# Altium project CMTestBoard.PrjPcb (part 1 of 2)
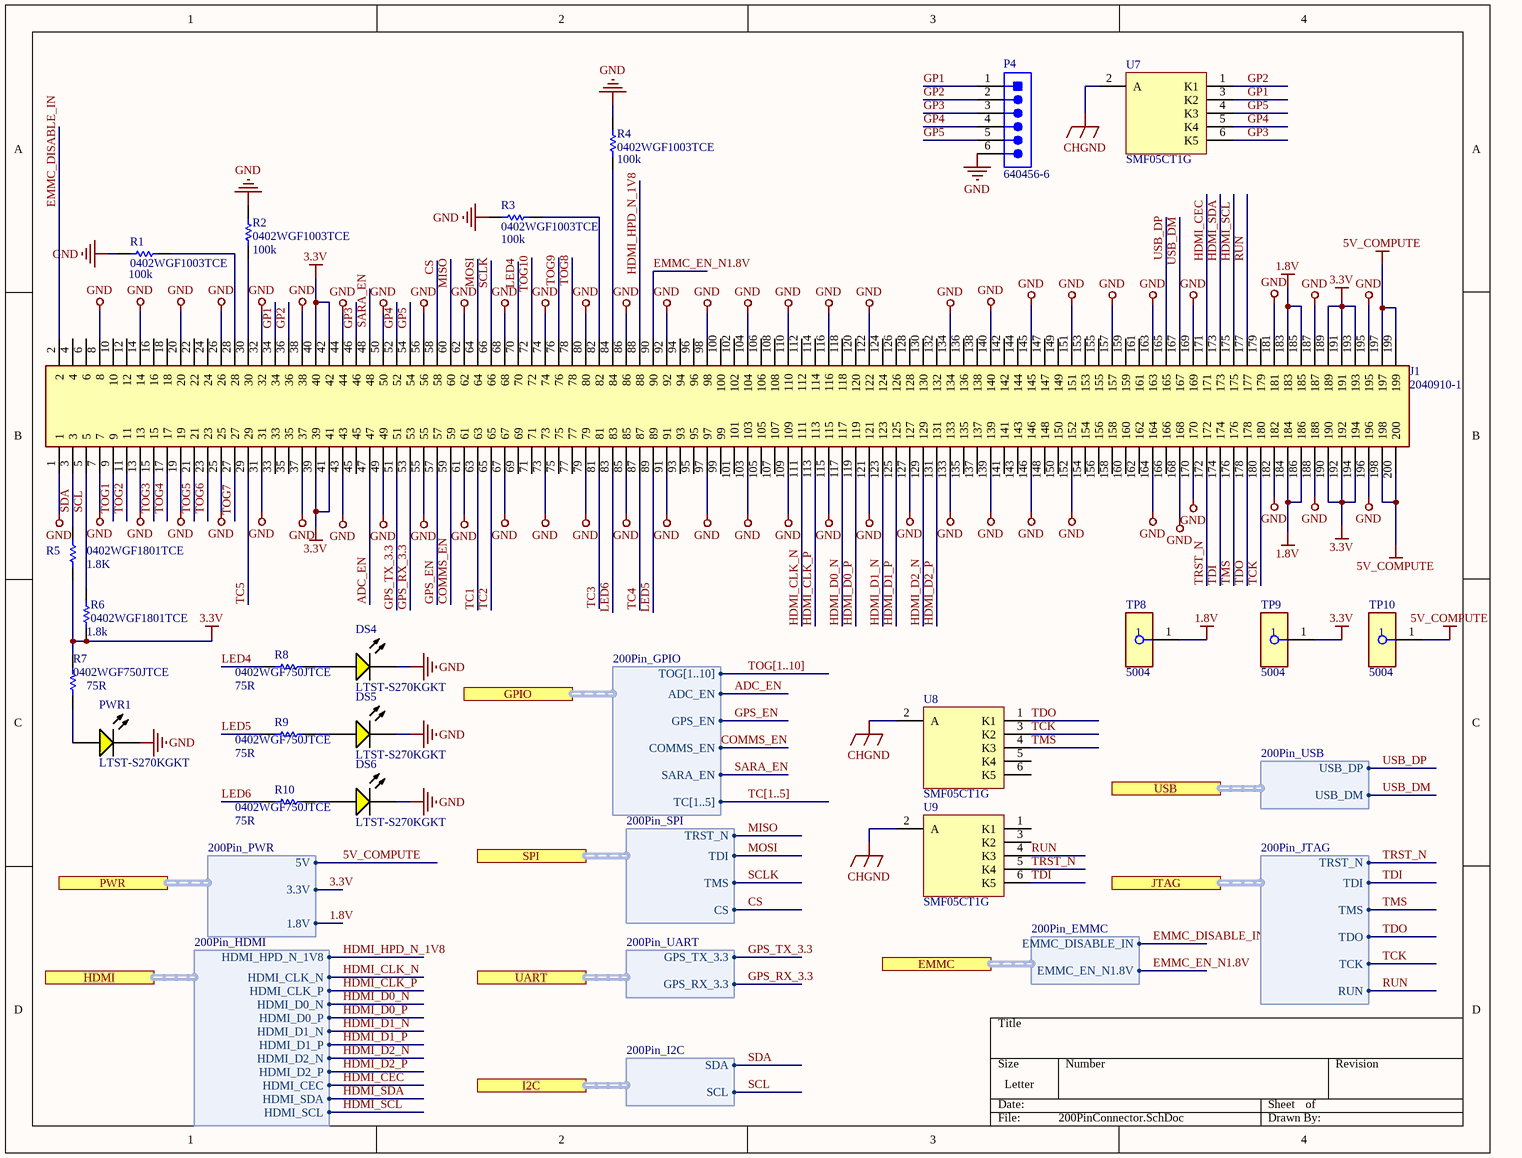
[diagram p0: 200PinConnector.SchDoc]
5 sheets, 156 parts. Net scope: flat (ports and power ports of the same name join across sheets).
Board file: CMTestBoard.PcbDoc
Sheets:
  200PinConnector.SchDoc
  CMPower.SchDoc
  Peripherals.SchDoc
  XC95144XL.SchDoc
  STM32F4.SchDoc

## Sheet 200PinConnector.SchDoc
size Letter

### Parts
DS4  LTST-S270KGKT  [AVAG-HSMX-C190_V]
DS5  LTST-S270KGKT  [AVAG-HSMX-C190_V]
DS6  LTST-S270KGKT  [AVAG-HSMX-C190_V]
J1  2040910-1  [20409101]
P4  640456-6  [TECO-640456-6_V]
PWR1  LTST-S270KGKT  [AVAG-HSMX-C190_V]
R1  0402WGF1003TCE  [0402]
R2  0402WGF1003TCE  [0402]
R3  0402WGF1003TCE  [0402]
R4  0402WGF1003TCE  [0402]
R5  0402WGF1801TCE  value 1.8K  [0402]
R6  0402WGF1801TCE  [0402]
R7  0402WGF750JTCE  [RESC1005X40X25ML05T10]
R8  0402WGF750JTCE  [RESC1005X40X25ML05T10]
R9  0402WGF750JTCE  [RESC1005X40X25ML05T10]
R10  0402WGF750JTCE  [RESC1005X40X25ML05T10]
TP8  5004  [FP-5004-MFG]
TP9  5004  [FP-5004-MFG]
TP10  5004  [FP-5004-MFG]
U7  SMF05CT1G  [ONSC-SC70-6-419B-02_W_V]
U8  SMF05CT1G  [ONSC-SC70-6-419B-02_W_V]
U9  SMF05CT1G  [ONSC-SC70-6-419B-02_W_V]

### Ports
EMMC (harness 200Pin_EMMC), GPIO (harness 200Pin_GPIO), HDMI (harness 200Pin_HDMI), I2C (harness 200Pin_I2C), JTAG (harness 200Pin_JTAG), PWR (harness 200Pin_PWR), SPI (harness 200Pin_SPI), UART (harness 200Pin_UART), USB (harness 200Pin_USB)

### Harnesses
200Pin_USB: USB_DP, USB_DM
200Pin_JTAG: TRST_N, TDI, TMS, TDO, TCK, RUN
200Pin_HDMI: HDMI_HPD_N_1V8, HDMI_CLK_N, HDMI_CLK_P, HDMI_D0_N, HDMI_D0_P, HDMI_D1_N, HDMI_D1_P, HDMI_D2_N, HDMI_D2_P, HDMI_CEC, HDMI_SDA, HDMI_SCL
200Pin_PWR: 5V, 3.3V, 1.8V
200Pin_I2C: SDA, SCL
200Pin_UART: GPS_TX_3.3, GPS_RX_3.3
200Pin_SPI: TRST_N, TDI, TMS, CS
200Pin_EMMC: EMMC_DISABLE_IN, EMMC_EN_N1.8V
200Pin_GPIO: TOG[1..10], ADC_EN, GPS_EN, COMMS_EN, SARA_EN, TC[1..5]

### Nets
1.8V: J1.183 J1.184 J1.185 J1.186 TP8.1 ; port PWR.1.8V
3.3V: J1.39 J1.40 J1.41 J1.42 J1.189 J1.190 J1.191 J1.192 J1.193 J1.194 R5.1 R6.1 R7.1 TP9.1 ; port PWR.3.3V
5V_COMPUTE: J1.197 J1.198 J1.199 J1.200 TP10.1 ; port PWR.5V  [project net 5V]
CHGND: U7.2(A) U8.2(A) U9.2(A)
GND: DS4.2(K) DS5.2(K) DS6.2(K) J1.1 J1.7 J1.8 J1.13 J1.14 J1.19 J1.20 J1.25 J1.26 J1.31 J1.32 J1.37 J1.38 J1.43 J1.44 J1.49 J1.50 J1.55 J1.56 J1.61 J1.62 J1.67 J1.68 J1.73 J1.74 J1.79 J1.80 J1.85 J1.86 J1.91 J1.92 J1.97 J1.98 J1.103 J1.104 J1.109 J1.110 J1.115 J1.116 J1.121 J1.122 J1.127 J1.133 J1.134 J1.139 J1.140 J1.145 J1.146 J1.151 J1.152 J1.157 J1.163 J1.164 J1.168 J1.169 J1.170 J1.181 J1.182 J1.187 J1.188 J1.195 J1.196 P4.6 PWR1.2(K) R1.2 R2.2 R3.2 R4.2
ADC_EN: J1.47 ; port GPIO.ADC_EN
COMMS_EN: J1.59 ; port GPIO.COMMS_EN
CS: J1.58 ; port SPI.CS
EMMC_DISABLE_IN: J1.2 ; port EMMC.EMMC_DISABLE_IN
EMMC_EN_N1.8V: J1.90 ; port EMMC.EMMC_EN_N1.8V
GP1: J1.34 P4.1 U7.3(K2)
GP2: J1.36 P4.2 U7.1(K1)
GP3: J1.46 P4.3 U7.6(K5)
GP4: J1.52 P4.4 U7.5(K4)
GP5: J1.54 P4.5 U7.4(K3)
GPS_EN: J1.57 ; port GPIO.GPS_EN
GPS_RX_3.3: J1.53 ; port UART.GPS_RX_3.3
GPS_TX_3.3: J1.51 ; port UART.GPS_TX_3.3
HDMI_CEC: J1.171 ; port HDMI.HDMI_CEC
HDMI_CLK_N: J1.111 ; port HDMI.HDMI_CLK_N
HDMI_CLK_P: J1.113 ; port HDMI.HDMI_CLK_P
HDMI_D0_N: J1.117 ; port HDMI.HDMI_D0_N
HDMI_D0_P: J1.119 ; port HDMI.HDMI_D0_P
HDMI_D1_N: J1.123 ; port HDMI.HDMI_D1_N
HDMI_D1_P: J1.125 ; port HDMI.HDMI_D1_P
HDMI_D2_N: J1.129 ; port HDMI.HDMI_D2_N
HDMI_D2_P: J1.131 ; port HDMI.HDMI_D2_P
HDMI_HPD_N_1V8: J1.88 ; port HDMI.HDMI_HPD_N_1V8
HDMI_SCL: J1.175 ; port HDMI.HDMI_SCL
HDMI_SDA: J1.173 ; port HDMI.HDMI_SDA
LED4: J1.70 R8.2
LED5: J1.89 R9.2
LED6: J1.83 R10.2
MISO: J1.60 ; port SPI.TRST_N
MOSI: J1.64 ; port SPI.TDI
RUN: J1.177 U9.4(K3) ; port JTAG.RUN
SARA_EN: J1.48 ; port GPIO.SARA_EN
SCL: J1.5 R6.2 ; port I2C.SCL
SCLK: J1.66 ; port SPI.TMS
SDA: J1.3 R5.2 ; port I2C.SDA
TC1: J1.63
TC2: J1.65
TC3: J1.81
TC4: J1.87
TC5: J1.29
TCK: J1.180 U8.3(K2) ; port JTAG.TCK
TDI: J1.174 U9.6(K5) ; port JTAG.TDI
TDO: J1.178 U8.1(K1) ; port JTAG.TDO
TMS: J1.176 U8.4(K3) ; port JTAG.TMS
TOG1: J1.9
TOG2: J1.11
TOG3: J1.15
TOG4: J1.17
TOG5: J1.21
TOG6: J1.23
TOG7: J1.27
TOG8: J1.78
TOG9: J1.76
TOG10: J1.72
TRST_N: J1.172 U9.5(K4) ; port JTAG.TRST_N
USB_DM: J1.167 ; port USB.USB_DM
USB_DP: J1.165 ; port USB.USB_DP
NetDS4_1: DS4.1(A) R8.1
NetDS5_1: DS5.1(A) R9.1
NetDS6_1: DS6.1(A) R10.1
NetJ1_28: J1.28 R1.1
NetJ1_30: J1.30 R2.1
NetJ1_82: J1.82 R3.1
NetJ1_84: J1.84 R4.1
NetPWR1_1: PWR1.1(A) R7.2

Not connected (* = marked no-connect by the designer): J1 4 6 10 12 16 18 22 24 33 35 45 69 71 75 77 93 94 95 96 99 100 101 102 105 106 107 108 112 114 118 120 124 126 128 130 132 135 136 137 138 141 142 143 144 147 148 149 150 153 154 155 156 158 159 160 161 162 166 179; U8 5(K4) 6(K5); U9 1(K1) 3(K2)

### Buses and harness runs
bus TC[1..5]
bus TOG[1..10]

### Notes on the sheet
- (near R4) 100k
- (near R1) 100k
- (near R2) 100k
- (near R3) 100k
- (near R6) 1.8k
- (near R7) 75R
- (near R8) 75R
- (near R9) 75R
- (near R10) 75R

### Library data of the parts
DS4-DS6 PWR1 = CMP-1744-00003-1: LED Uni-Color Yellow, 65 mW, 20 mA, -40 to 85 degC, 2-Pin SMD, RoHS, Tape and Reel; Tolerance: 1%; Voltage Rating: 50 V; Power Rating: 100 mW; Case\Package: 0603; Resistance: 390 Ohm; Min Operating Temperature: -55 degC; Length: 1.6 mm; ComponentLink3Description: Package Specification; Mount: Surface Mount; PackageReference: HSMX-C190; ComponentLink2Description: Datasheet; DatasheetVersion: Mar-12; Case Code (Metric): 1608; Pins: 2; Package Quantity: 5000; ComponentLink2URL: http://docs.avagotech.com/docs/AV02-0551EN; ComponentLink1Description: Manufacturer URL; RoHSCompliant: true; Packaging: Tape and Reel; PackageDescription: 2-Pin Surface Mount Device, Body 1.6 x 0.8 mm, Height 0.9 mm; REACH SVHC: No SVHC; ComponentLink3URL: http://www.fairchildsemi.com/dwg/MA/MA03D.pdf; Voltage Rating (DC): 50 V; Width: 0.8 mm; ComponentLink1URL: http://www.avagotech.com/; Max Operating Temperature: 155 degC; Case Code (Imperial): 0603; Height: 0.45 mm
J1 = 2040910-1: 200 Pin Connector; Manufacturer_Name: TE Connectivity; Datasheet Link: https://www.arrow.com/en/products/2040910-1/te-connectivity; Height: 15mm; Manufacturer_Part_Number: 2040910-1; Arrow Part Number: 2040910-1; Arrow Price/Stock: https://www.arrow.com/en/products/2040910-1/te-connectivity; Mouser Part Number: 571-2040910-1; Mouser Price/Stock: https://www.mouser.co.uk/ProductDetail/TE-Connectivity/2040910-1?qs=kAqyOuzYGe9tF8FZbDgYRA%3D%3D
P4 = CMP-2000-05661-1: Male Header, Pitch 2.54 mm, 1 x 6 Position, Height 10.03 mm, Tail Length 3.56 mm, -55 to 105 degC, Bulk; Manufacturer: TE Connectivity; Contact Centerline Spacing: 0.100 / in.; Number of Contacts: 6; Current, Rating: 5 / A; Agency Approvals: CSA,UL; Material, Contact: CopperAlloy; Mounting Hole Size: 0.04 / "; Brand/Series: MTA-100Series; Pin Spacing: 0.1 / "; Mount Angle: Vertical; Contact Termination Area Plating: Tin; Angle: Straight; Primary Type: InterconnectSystem; Standards: RoHSCompliant,ELVCompliant,UL94V-0; Temperature, Operating: -55to+105 / °C; Material, Housing: Polyester; Special Features: Pinstrip; Color, Housing: White; Connector Type: MTA-100; Voltage, Rating: 250 / V; Termination: Solder; Package Reference: 640456-6; Size, Post: 0.025 / in.; Color: White; Datasheet URL: https://datasheet.ciiva.com/25618/0900766b80eb7fdd-25618163.pdf; Manufacturer URL: http://www.te.com/; Mounting Type: PCMount; Length, Pin: 0.14 / "; Type: PCBPlug; Length, Overall: 0.6 / "; Mounting Technology: ThroughHole; Number of Rows: 1; Contact Shape: Square; Contact Mating Area Plating: Tin; Datasheet Version: Rev. W, 05/2005; Number of Positions: 6; Package Description: Male Header, Pitch 2.54 mm, 1 x 6 Position, Height 10.03 mm, Tail Length 3.56 mm; Contact Plating: Tin; Length, Terminal Post: 0.14 / in.; Flammability Rating: UL94V-0
R1-R4 = Res1: 100k 0402; Published: 8-Jun-2000; LatestRevisionDate: 17-Jul-2002; LatestRevisionNote: Re-released for DXP Platform.; PackageReference: AXIAL-0.3; Publisher: Altium Limited; PackageDescription: Axial Device, Thru-Hole; 2 Leads; 0.3 in Pin Spacing
  R1: Case Code (Imperial): 0402
R5 R6 = Res1: 1.8k 0402; Published: 8-Jun-2000; LatestRevisionDate: 17-Jul-2002; LatestRevisionNote: Re-released for DXP Platform.; PackageReference: AXIAL-0.3; Publisher: Altium Limited; PackageDescription: Axial Device, Thru-Hole; 2 Leads; 0.3 in Pin Spacing
R7-R10 = CMP-2002-07344-1: 75R 0402; Part Number: RC0402FR-07100RL; Manufacturer: Yageo / Phycomp
TP8-TP10 = CMP-2000-05575-2: PC TEST POINT MINIATURE YELLOW; Manufacturer: Keystone; Number Of Contacts: 1; Is Female: yes; Device Class L1: Connectors; Manufacturer Part Number: 5004; Digikey Description: PC TEST POINT MINIATURE YELLOW; ComponentLink2URL: https://www.keyelco.com/product-pdf.cfm?p=1313; Lead Free: Yes; ComponentLink2Description: Datasheet; Category: Conn; Height: 4.72mm; Octopart: https://octopart.com/5004-keystone-28591; Mouser Description: TEST POINT PC MINI .040"D YELLOW; Device Class L3: unset; Contact Material: Silver; Package: 5004; Automotive: No; Device Class L2: unset; RoHS: TRUE
U7-U9 = CMP-1061-00155-1: 5-Line Transient Voltage Suppressor Array, 6-Pin SC70, Pb-Free, Tape and Reel; Manufacturer: On Semiconductor; PPK Max (W): 100; Direction: Unidirectional; IR Max (uA): 5; PackageDescription: 6-Pin Small Outline Transistor, Body 2 x 1.25 mm, Pitch 0.65 mm; PackageReference: SC70-6-419B-02_W; ComponentLink2Description: Datasheet; Mounting Technology: Surface Mount; Packing: Tape and Reel; DatasheetVersion: Rev. 4; ComponentLink1Description: Manufacturer URL; ComponentLink2URL: http://www.onsemi.com/pub_link/Collateral/SMF05C-D.PDF; ComponentLink3Description: Package Specification; ComponentLink1URL: http://www.onsemi.com/; ComponentLink3URL: http://www.onsemi.com/pub_link/Collateral/SMF05C-D.PDF; PackageVersion: Rev. W; PartNumber: SMF05CT1G; RoHS: Pb-Free

## Sheet CMPower.SchDoc
size Letter
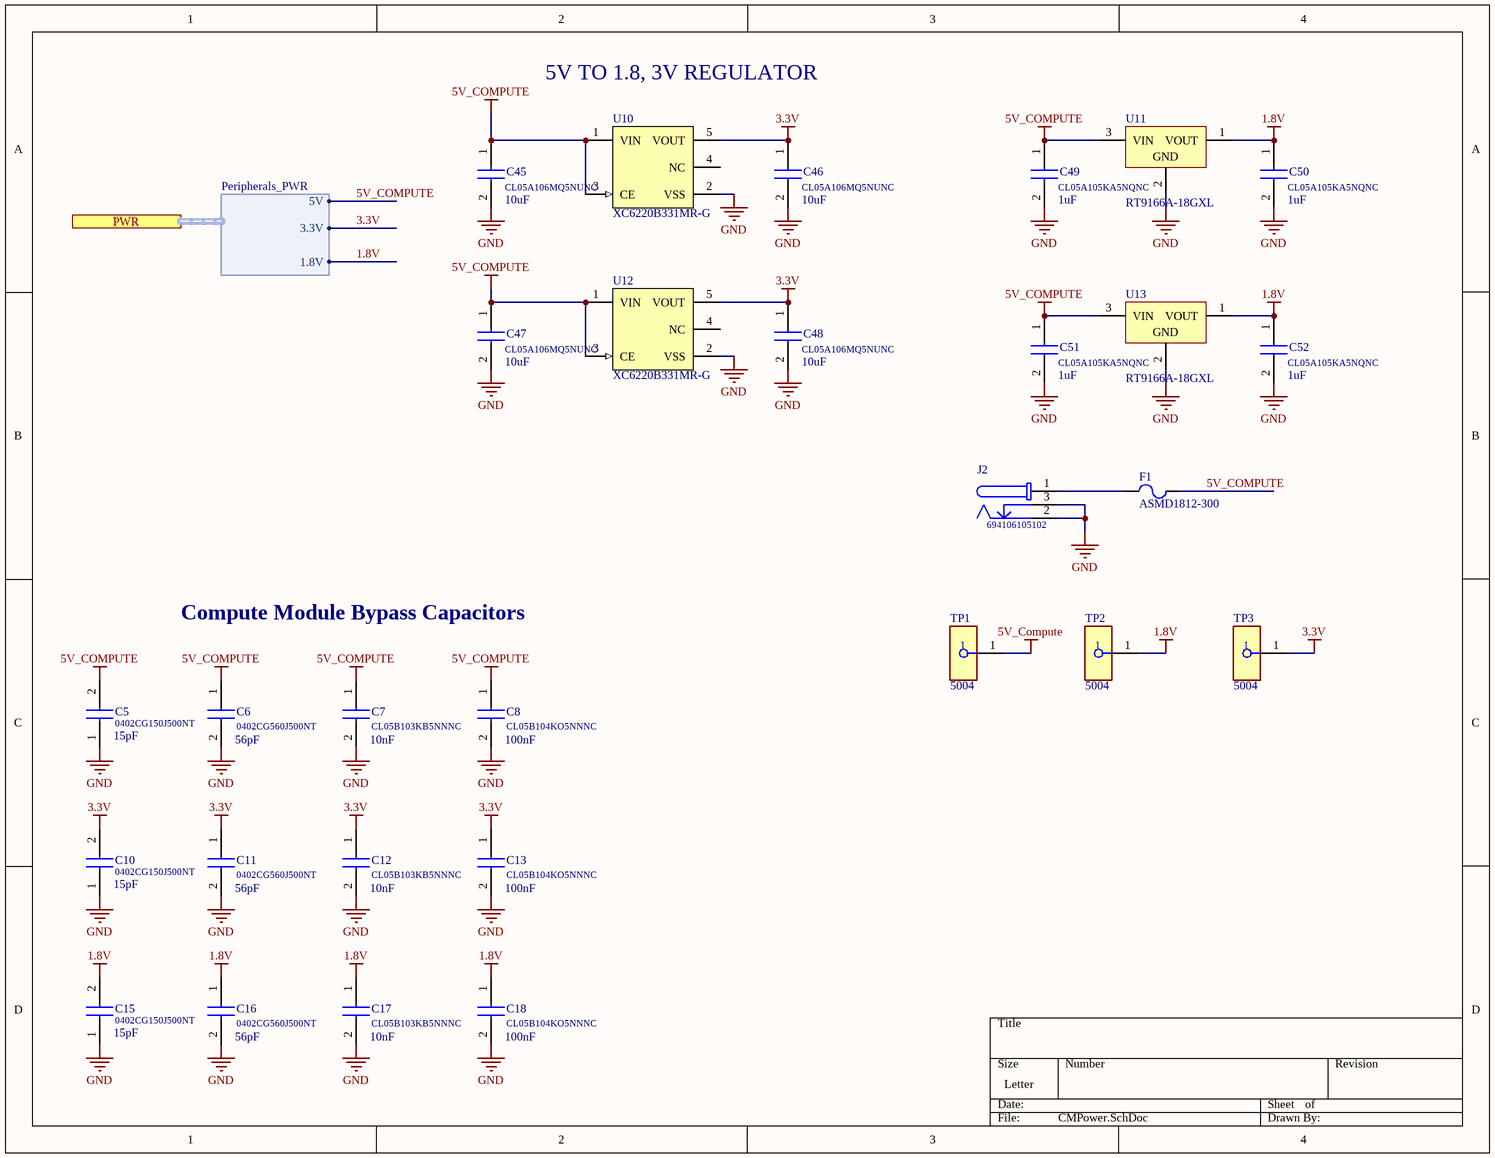
[diagram p1: CMPower.SchDoc]

### Parts
C5  0402CG150J500NT  value 15pF  [CAPC1005X90N]
C6  0402CG560J500NT  value 56pF  [CAPC1005X55N]
C7  CL05B103KB5NNNC  value 10nF  [CAPC1005X55N]
C8  CL05B104KO5NNNC  value 100nF  [CAPC1005X55N]
C10  0402CG150J500NT  value 15pF  [CAPC1005X90N]
C11  0402CG560J500NT  value 56pF  [CAPC1005X55N]
C12  CL05B103KB5NNNC  value 10nF  [CAPC1005X55N]
C13  CL05B104KO5NNNC  value 100nF  [CAPC1005X55N]
C15  0402CG150J500NT  value 15pF  [CAPC1005X90N]
C16  0402CG560J500NT  value 56pF  [CAPC1005X55N]
C17  CL05B103KB5NNNC  value 10nF  [CAPC1005X55N]
C18  CL05B104KO5NNNC  value 100nF  [CAPC1005X55N]
C45  CL05A106MQ5NUNC  value 10uF  [CAPC1005X55N]
C46  CL05A106MQ5NUNC  value 10uF  [CAPC1005X55N]
C47  CL05A106MQ5NUNC  value 10uF  [CAPC1005X55N]
C48  CL05A106MQ5NUNC  value 10uF  [CAPC1005X55N]
C49  CL05A105KA5NQNC  value 1uF  [CAPC1005X55N]
C50  CL05A105KA5NQNC  value 1uF  [CAPC1005X55N]
C51  CL05A105KA5NQNC  value 1uF  [CAPC1005X55N]
C52  CL05A105KA5NQNC  value 1uF  [CAPC1005X55N]
F1  ASMD1812-300  [LFUS-FUSE1812-71_V]
J2  694106105102  [694106105102]
TP1  5004  [FP-5004-MFG]
TP2  5004  [FP-5004-MFG]
TP3  5004  [FP-5004-MFG]
U10  XC6220B331MR-G  [TORX-SOT-25-5_M]
U11  RT9166A-18GXL  [SOT-89_N]
U12  XC6220B331MR-G  [TORX-SOT-25-5_M]
U13  RT9166A-18GXL  [SOT-89_N]

### Ports
PWR (harness Peripherals_PWR)

### Harnesses
Peripherals_PWR: 5V, 3.3V, 1.8V

### Nets
1.8V: C15.2 C16.1 C17.1 C18.1 C50.1 C52.1 TP2.1 U11.1(VOUT) U13.1(VOUT) ; port PWR.1.8V
3.3V: C10.2 C11.1 C12.1 C13.1 C46.1 C48.1 TP3.1 U10.5(VOUT) U12.5(VOUT) ; port PWR.3.3V
5V_COMPUTE: C5.2 C6.1 C7.1 C8.1 C45.1 C47.1 C49.1 C51.1 F1.2 TP1.1 U10.1(VIN) U10.3(CE) U11.3(VIN) U12.1(VIN) U12.3(CE) U13.3(VIN) ; port PWR.5V  [project net 5V]
GND: C5.1 C6.2 C7.2 C8.2 C10.1 C11.2 C12.2 C13.2 C15.1 C16.2 C17.2 C18.2 C45.2 C46.2 C47.2 C48.2 C49.2 C50.2 C51.2 C52.2 J2.2 J2.3 U10.2(VSS) U11.2(GND) U12.2(VSS) U13.2(GND)
NetF1_1: F1.1 J2.1

Not connected (* = marked no-connect by the designer): U10 4(NC); U12 4(NC)

### Notes on the sheet
- 5V TO 1.8, 3V REGULATOR
- Compute Module Bypass Capacitors

### Library data of the parts
C5 C10 C15 = C0402C150J4GACTU: 15pF 0402; Manufacturer_Name: Kemet; Datasheet Link: https://content.kemet.com/datasheets/KEM_C1002_X7R_SMD.pdf; Height: 0.55mm; Manufacturer_Part_Number: C0402C150J4GACTU; Arrow Part Number: C0402C150J4GACTU; Arrow Price/Stock: https://www.arrow.com/en/products/c0402c150j4gactu/kemet-corporation; Mouser Part Number: 80-C0402C150J4G; Mouser Price/Stock: https://www.mouser.com/Search/Refine.aspx?Keyword=80-C0402C150J4G
C6 C11 C16 = C0402C560K5RACTU: 56pF 0402; Manufacturer_Name: Kemet; Datasheet Link: https://content.kemet.com/datasheets/KEM_C1002_X7R_SMD.pdf; Height: 0.55mm; Manufacturer_Part_Number: C0402C560K5RACTU; Arrow Part Number: C0402C560K5RACTU; Mouser Part Number: 80-C0402C560K5RACTU; Mouser Price/Stock: https://www.mouser.co.uk/ProductDetail/KEMET/C0402C560K5RACTU?qs=gt1LBUVyoHmQZW5v3ySgNQ%3D%3D
C7 C12 C17 = C0402C103K8RACTU: 10nF 0402; Manufacturer_Name: Kemet; Datasheet Link: https://content.kemet.com/datasheets/KEM_C1002_X7R_SMD.pdf; Height: 0.55mm; Manufacturer_Part_Number: C0402C103K8RACTU; Arrow Part Number: C0402C103K8RACTU; Arrow Price/Stock: https://www.arrow.com/en/products/c0402c103k8ractu/kemet-corporation; Mouser Part Number: 80-C0402C103K8R; Mouser Price/Stock: https://www.mouser.co.uk/ProductDetail/KEMET/C0402C103K8RACTU?qs=JAINH4q0Y0HkMNTUebnT7w%3D%3D
C8 C13 C18 = C0402C560K5RACTU: 100nF 0402; Manufacturer_Name: Kemet; Datasheet Link: https://content.kemet.com/datasheets/KEM_C1002_X7R_SMD.pdf; Height: 0.55mm; Manufacturer_Part_Number: C0402C560K5RACTU; Arrow Part Number: C0402C560K5RACTU; Mouser Part Number: 80-C0402C560K5RACTU; Mouser Price/Stock: https://www.mouser.co.uk/ProductDetail/KEMET/C0402C560K5RACTU?qs=gt1LBUVyoHmQZW5v3ySgNQ%3D%3D
C45-C48 = C0402C560K5RACTU: 10uF 0402; Manufacturer_Name: Kemet; Datasheet Link: https://content.kemet.com/datasheets/KEM_C1002_X7R_SMD.pdf; Height: 0.55mm; Manufacturer_Part_Number: C0402C560K5RACTU; Arrow Part Number: C0402C560K5RACTU; Mouser Part Number: 80-C0402C560K5RACTU; Mouser Price/Stock: https://www.mouser.co.uk/ProductDetail/KEMET/C0402C560K5RACTU?qs=gt1LBUVyoHmQZW5v3ySgNQ%3D%3D
C49-C52 = C0402C560K5RACTU: 1uF 0402; Manufacturer_Name: Kemet; Datasheet Link: https://content.kemet.com/datasheets/KEM_C1002_X7R_SMD.pdf; Height: 0.55mm; Manufacturer_Part_Number: C0402C560K5RACTU; Arrow Part Number: C0402C560K5RACTU; Mouser Part Number: 80-C0402C560K5RACTU; Mouser Price/Stock: https://www.mouser.co.uk/ProductDetail/KEMET/C0402C560K5RACTU?qs=gt1LBUVyoHmQZW5v3ySgNQ%3D%3D
F1 = CMP-0257-00001-1: Resettable PTC, 1812, 3 A Ihold, 5 A Itrip, 8V max; PartNumber: 1812L150ZR; Itrip: 3 A; Vmax: 8 Vdc; Ihold: 1.5 A; Imax: 100 A; PackageReference: FUSE1812-71; ComponentLink1Description: Manufacturer URL; DatasheetVersion: 6/2012; ComponentLink2URL: http://www.littelfuse.com/products/resettable-ptcs/surface-mount/1812l/~/media/Electronics_Technical/Datasheets/Resettable_PTCs/Littelfuse_PTC_1812L_Datasheet.pdf; PackageVersion: 6/2012; PackageDescription: 2-Pin SMT Fuse, 4.55 x 3.24 mm Body; ComponentLink1URL: http://www.littelfuse.com/; ComponentLink2Description: Datasheet
J2 = CMP-1502-00176-1: DC Power Jack Connector with Pegs WR-DC, Male, Right Angled, SMT, 5 A, 24 V; Manufacturer: Wurth Elektronik; Plug Outer Diameter: 5.5mm; Opening Diameter: 6.4mm; Plug Inner Diameter: 2.05mm; Rated Current: 5A; Working Voltage: 24V; Publisher: WurthElektronik; Operating Temperature: -40to85degC; Packaging: TapeandReel; Part Number: 694106105102; Manufacturer URL: http://www.we-online.de; Mounting Technology: SMT; Gender: Male; Package Reference: 694106105102; Datasheet URL: http://katalog.we-online.de/em/datasheet/6941xx105102.pdf; Orientation: RightAngled
TP1-TP3 = CMP-2000-05575-2: as TP8 on sheet 200PinConnector; Device Class L1: Connectors; Manufacturer Part Number: 5004; Digikey Description: PC TEST POINT MINIATURE YELLOW; ComponentLink2URL: https://www.keyelco.com/product-pdf.cfm?p=1313; Lead Free: Yes; ComponentLink2Description: Datasheet; Category: Conn; Height: 4.72mm; Octopart: https://octopart.com/5004-keystone-28591; Mouser Description: TEST POINT PC MINI .040"D YELLOW; Device Class L3: unset; Contact Material: Silver; Package: 5004; Automotive: No; Device Class L2: unset; RoHS: TRUE
U10 U12 = CMP-0599-00001-2: 1A LDO Voltage Regulator with CL discharge, 3.3 V, 1000 mA, -45 to 85 degC, 5-Pin SOT-25, RoHS, Reel; Manufacturer: Torex; Output Voltage: 3.3 V; Maximum Output Current: 1000 mA; ComponentLink1Description: Manufacturer URL; ComponentLink2URL: http://www.torex.co.jp/english/products/voltage_regulators/data/XC6220.pdf; DatasheetVersion: ETR0341-010a; ComponentLink1URL: http://www.torex.co.jp/; Mounting Technology: Surface Mount; Operating Ambient Temperature: -40 to 85 degC; PackageReference: SOT-25-5; PackageDescription: 5-Pin Small Out-Line Transistor, Body 2.9 x 1.65 mm, Pitch 0.95 mm; PartNumber: XC6220B331MR-G; RoHS: TRUE; Packing: Reel; ComponentLink2Description: Datasheet
U11 U13 = CMP-0244-00406-1: Positive Voltage Regulator, 5V, 4-Pin SOT-89, Tape and Reel; PackageVersion: 2011; DatasheetVersion: 1/02/2011; PackageDescription: 3-Pin SOT-89 Package 1.5 mm Pitch, 4.1 mm Lead Span; PackageReference: SOT-89; ComponentLink2Description: Datasheet; ComponentLink1URL: http://www.st.com; ComponentLink1Description: Manufacturer URL; ComponentLink2URL: http://www.st.com/internet/com/TECHNICAL_RESOURCES/TECHNICAL_LITERATURE/DATASHEET/CD00000446.pdf

## Sheet Peripherals.SchDoc
size Letter
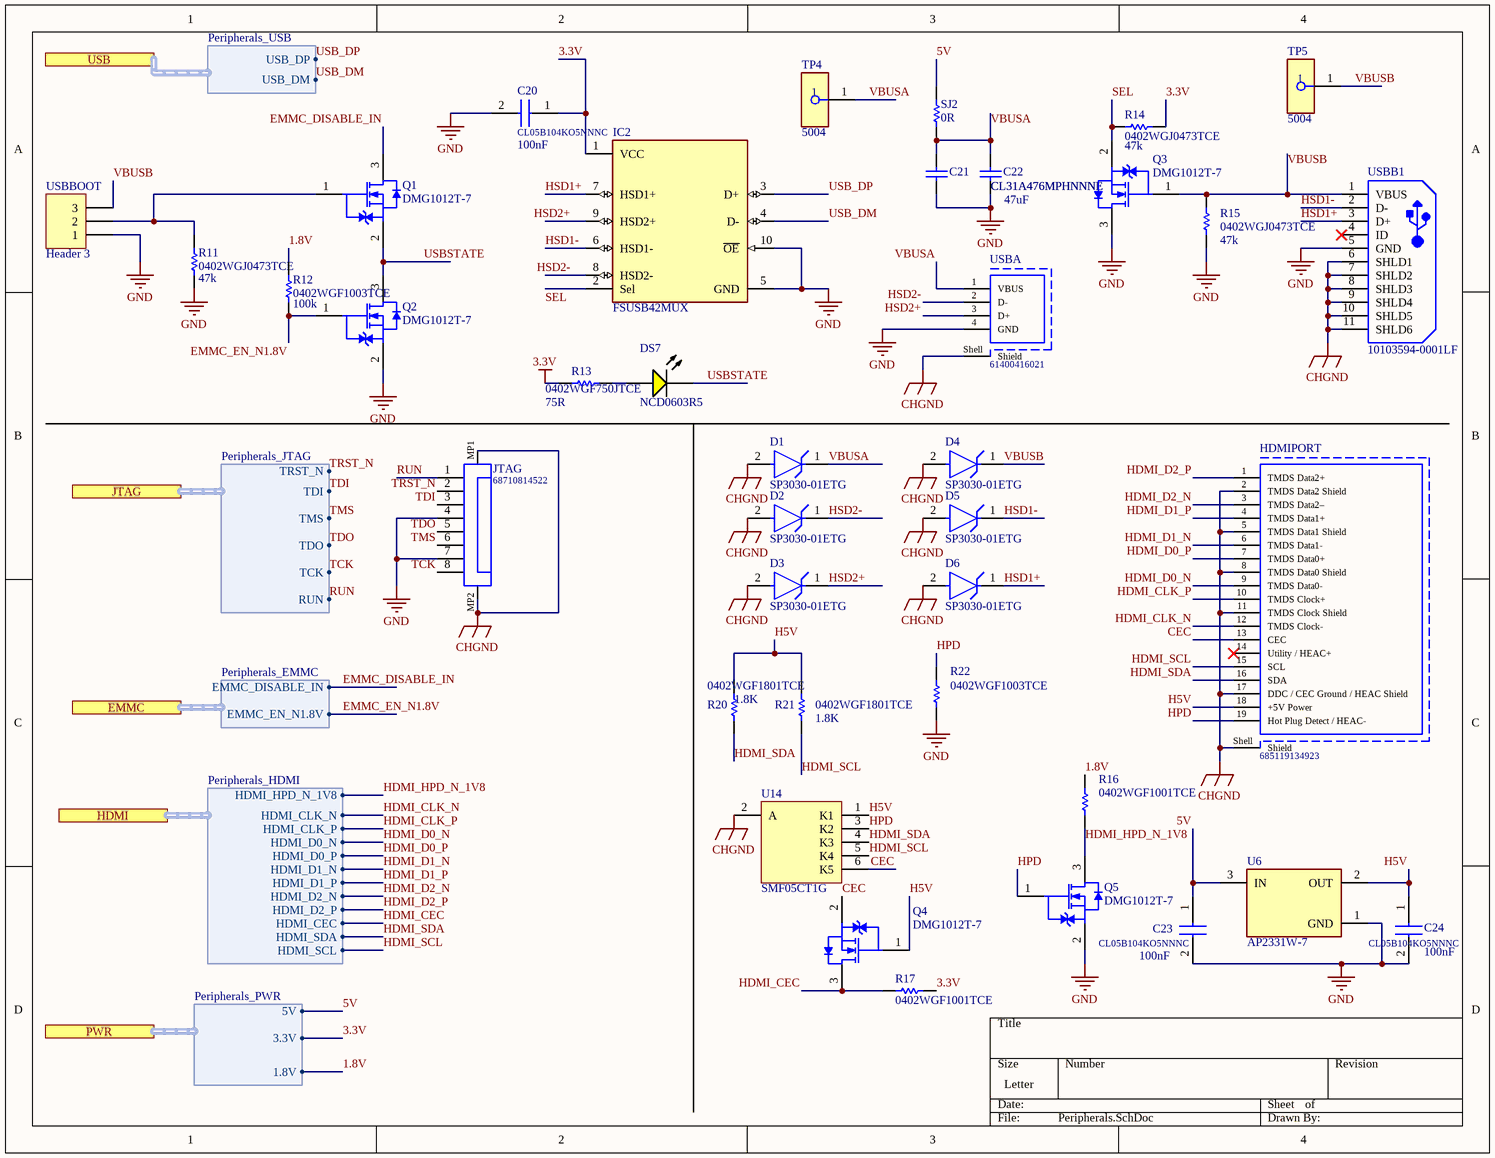
[diagram p2: Peripherals.SchDoc]

### Parts
(Parts that share a designator on the sheet are numbered #1, #2 ... from top to bottom, then left to right.)
C20#1  CL05B104KO5NNNC  value 100nF  [CAPC1005X55N]
C21#1  CL31A476MPHNNNE  [C1206]
C22#1  CL31A476MPHNNNE  [C1206]
C23#1  CL05B104KO5NNNC  value 100nF  [CAPC1005X55N]
C24#1  CL05B104KO5NNNC  value 100nF  [CAPC1005X55N]
D1  SP3030-01ETG  [FP-SP3030-MFG]
D2  SP3030-01ETG  [FP-SP3030-MFG]
D3  SP3030-01ETG  [FP-SP3030-MFG]
D4  SP3030-01ETG  [FP-SP3030-MFG]
D5  SP3030-01ETG  [FP-SP3030-MFG]
D6  SP3030-01ETG  [FP-SP3030-MFG]
DS7  NCD0603R5  [AVAG-HSMX-C190_V]
HDMIPORT  685119134923  [685119134923]
IC2  FSUSB42MUX  [FP-846AP-MFG]
JTAG  68710814522  [68710814522]
Q1  DMG1012T-7  [DIOD-SOT523-3_V]
Q2  DMG1012T-7  [DIOD-SOT523-3_V]
Q3  DMG1012T-7  [DIOD-SOT523-3_V]
Q4  DMG1012T-7  [DIOD-SOT523-3_V]
Q5  DMG1012T-7  [DIOD-SOT523-3_V]
R11#1  0402WGJ0473TCE  [0402-A]
R12#1  0402WGF1003TCE  [0402]
R13#1  0402WGF750JTCE  spec: 75R  [RESC1005X40X25ML05T10]
R14#1  0402WGJ0473TCE  [0402-A]
R15#1  0402WGJ0473TCE  [0402-A]
R16#1  0402WGF1001TCE  [0402]
R17  0402WGF1001TCE  [0402]
R20  0402WGF1801TCE  value 1.8K  [0402]
R21  0402WGF1801TCE  value 1.8K  [0402]
R22  0402WGF1003TCE  [0402]
SJ2  0R  [J1-0603]
TP4  5004  [FP-5004-MFG]
TP5  5004  [FP-5004-MFG]
U6  AP2331W-7  [FP-SC59-IPC_B]
U14  SMF05CT1G  [ONSC-SC70-6-419B-02_W_V]
USBA  61400416021  [61400416021]
USBB1  10103594-0001LF  [FCI-10103594-0001LF_V]
USBBOOT  Header 3  [HDR1X3]

### Ports
EMMC (harness Peripherals_EMMC), HDMI (harness Peripherals_HDMI), JTAG (harness Peripherals_JTAG), PWR (harness Peripherals_PWR), USB (harness Peripherals_USB)

### Harnesses
Peripherals_USB: USB_DP, USB_DM
Peripherals_HDMI: HDMI_HPD_N_1V8, HDMI_CLK_N, HDMI_CLK_P, HDMI_D0_N, HDMI_D0_P, HDMI_D1_N, HDMI_D1_P, HDMI_D2_N, HDMI_D2_P, HDMI_CEC, HDMI_SDA, HDMI_SCL
Peripherals_JTAG: TRST_N, TDI, TMS, TDO, TCK, RUN
Peripherals_PWR: 5V, 3.3V, 1.8V
Peripherals_EMMC: EMMC_DISABLE_IN, EMMC_EN_N1.8V

### Nets
1.8V: R12#1.2 R16#1.1 ; port PWR.1.8V
3.3V: C20#1.1 IC2.1(VCC) R13#1.2 R14#1.1 R17.2 ; port PWR.3.3V
5V: C23#1.1 SJ2.2 U6.3(IN) ; port PWR.5V
CHGND: D1.2(A) D2.2(A) D3.2(A) D4.2(A) D5.2(A) D6.2(A) HDMIPORT.2(TMDS_Data2_Shield) HDMIPORT.5(TMDS_Data1_Shield) HDMIPORT.8(TMDS_Data0_Shield) HDMIPORT.11(TMDS_Clock_Shield) HDMIPORT.17(DDC_/_CEC_Ground_/_HEAC_Shield) HDMIPORT.Shell(Shield) JTAG.MP1 JTAG.MP2 U14.2(A) USBA.Shell(Shield) USBB1.6(SHLD1) USBB1.7(SHLD2) USBB1.8(SHLD3) USBB1.9(SHLD4) USBB1.10(SHLD5) USBB1.11(SHLD6)
GND: C20#1.2 C21#1.1 C22#1.1 C23#1.2 C24#1.2 IC2.5(GND) IC2.10(~{OE}) JTAG.4 JTAG.7 Q2.2(S) Q3.3(D) Q5.2(S) R11#1.1 R15#1.1 R22.2 U6.1(GND) USBA.4(GND) USBB1.5(GND) USBBOOT.1
CEC: HDMIPORT.13(CEC) Q4.2(S) U14.6(K5)
EMMC_DISABLE_IN: Q1.3(D) ; port EMMC.EMMC_DISABLE_IN
EMMC_EN_N1.8V: Q2.1(G) R12#1.1 ; port EMMC.EMMC_EN_N1.8V
H5V: C24#1.1 HDMIPORT.18(+5V_Power) Q4.1(G) R20.2 R21.2 U6.2(OUT) U14.1(K1)
HDMI_CEC: Q4.3(D) R17.1 ; port HDMI.HDMI_CEC
HDMI_CLK_N: HDMIPORT.12(TMDS_Clock-) ; port HDMI.HDMI_CLK_N
HDMI_CLK_P: HDMIPORT.10(TMDS_Clock+) ; port HDMI.HDMI_CLK_P
HDMI_D0_N: HDMIPORT.9(TMDS_Data0-) ; port HDMI.HDMI_D0_N
HDMI_D0_P: HDMIPORT.7(TMDS_Data0+) ; port HDMI.HDMI_D0_P
HDMI_D1_N: HDMIPORT.6(TMDS_Data1-) ; port HDMI.HDMI_D1_N
HDMI_D1_P: HDMIPORT.4(TMDS_Data1+) ; port HDMI.HDMI_D1_P
HDMI_D2_N: HDMIPORT.3(TMDS_Data2–) ; port HDMI.HDMI_D2_N
HDMI_D2_P: HDMIPORT.1(TMDS_Data2+) ; port HDMI.HDMI_D2_P
HDMI_HPD_N_1V8: Q5.3(D) R16#1.2 ; port HDMI.HDMI_HPD_N_1V8
HDMI_SCL: HDMIPORT.15(SCL) R21.1 U14.5(K4) ; port HDMI.HDMI_SCL
HDMI_SDA: HDMIPORT.16(SDA) R20.1 U14.4(K3) ; port HDMI.HDMI_SDA
HPD: HDMIPORT.19(Hot_Plug_Detect_/_HEAC-) Q5.1(G) R22.1 U14.3(K2)
HSD1+: D6.1(C) IC2.7(HSD1+) USBB1.3(D+)
HSD1-: D5.1(C) IC2.6(HSD1-) USBB1.2(D-)
HSD2+: D3.1(C) IC2.9(HSD2+) USBA.3(D+)
HSD2-: D2.1(C) IC2.8(HSD2-) USBA.2(D-)
RUN: JTAG.1 ; port JTAG.RUN
SEL: IC2.2(Sel) Q3.2(S) R14#1.2
TCK: JTAG.8 ; port JTAG.TCK
TDI: JTAG.3 ; port JTAG.TDI
TDO: JTAG.5 ; port JTAG.TDO
TMS: JTAG.6 ; port JTAG.TMS
TRST_N: JTAG.2 ; port JTAG.TRST_N
USB_DM: IC2.4(D-) ; port USB.USB_DM
USB_DP: IC2.3(D+) ; port USB.USB_DP
USBSTATE: DS7.2(K) Q1.2(S) Q2.3(D)
VBUSA: C21#1.2 C22#1.2 D1.1(C) SJ2.1 TP4.1 USBA.1(VBUS)
VBUSB: D4.1(C) Q3.1(G) R15#1.2 TP5.1 USBB1.1(VBUS) USBBOOT.3
NetDS7_1: DS7.1(A) R13#1.1
NetQ1_1: Q1.1(G) R11#1.2 USBBOOT.2

Not connected (* = marked no-connect by the designer): HDMIPORT 14(Utility_/_HEAC+)*; USBB1 4(ID)*

### Notes on the sheet
- 47k
- (near C22#1) 47uF
- (near R11#1) 47k
- (near R15#1) 47k
- (near R12#1) 100k

### Library data of the parts
C20#1 C23#1 C24#1 = C0402C560K5RACTU: 100nF 0402; Manufacturer_Name: Kemet; Datasheet Link: https://content.kemet.com/datasheets/KEM_C1002_X7R_SMD.pdf; Height: 0.55mm; Manufacturer_Part_Number: C0402C560K5RACTU; Arrow Part Number: C0402C560K5RACTU; Mouser Part Number: 80-C0402C560K5RACTU; Mouser Price/Stock: https://www.mouser.co.uk/ProductDetail/KEMET/C0402C560K5RACTU?qs=gt1LBUVyoHmQZW5v3ySgNQ%3D%3D
C21#1 C22#1 = Cap: 47uF 1206; Published: 8-Jun-2000; LatestRevisionDate: 17-Jul-2002; LatestRevisionNote: Re-released for DXP Platform.; PackageReference: RAD-0.3; Publisher: Altium Limited; PackageDescription: Radial Cap, Thru-Hole; 2 Leads; 0.3 in Pin Spacing; Value: 47uF; LCSC Part #: C96123
D1-D6 = CMP-08607-000070-1: TVS DIODE 5V 10V SOD882; Manufacturer: Littelfuse; Max Junction Temp: +150°C; Automotive Grade: Grade 1; Direction: Unidirectional; Peak Pulse Current: 3A; Capacitance: 0.5pF; Value: 0.5pF; Number Of Channels: 1; Manufacturer Part Number: SP3030-01ETG; Temperature Range Low: -40°C; Lead Free: Yes; Package: SP3030; Device Class L2: TVS Diodes; Height: 0.6mm; ComponentLink2URL: https://www.littelfuse.com/~/media/electronics/datasheets/tvs_diode_arrays/littelfuse_tvs_diode_array_sp3030_datasheet.pdf.pdf; Device Class L3: unset; Category: Diode; Reverse Standoff Voltage: 5V; RoHS: TRUE; Digikey Description: TVS DIODE 5V 10V SOD882; Octopart: https://octopart.com/sp3030-01etg-littelfuse-29687287; ComponentLink2Description: Datasheet; Device Class L1: Circuit Protection; Automotive: Yes; Temperature: -40°C to +125°C; Temperature Range High: +125°C; Clamping Voltage: 10V; Mouser Description: TVS Diodes / ESD Suppressors 5V 1uA 22kV UNIDIRECTIONAL
DS7 = CMP-1744-00003-1: 0603 LIGHT EMITTING DIODES (LED) ROHS; Tolerance: 1%; Voltage Rating: 50 V; Power Rating: 100 mW; Case\Package: 0603; Resistance: 390 Ohm; Min Operating Temperature: -55 degC; Length: 1.6 mm; ComponentLink3Description: Package Specification; Mount: Surface Mount; PackageReference: HSMX-C190; ComponentLink2Description: Datasheet; DatasheetVersion: Mar-12; Case Code (Metric): 1608; Pins: 2; Package Quantity: 5000; ComponentLink2URL: http://docs.avagotech.com/docs/AV02-0551EN; ComponentLink1Description: Manufacturer URL; RoHSCompliant: true; Packaging: Tape and Reel; PackageDescription: 2-Pin Surface Mount Device, Body 1.6 x 0.8 mm, Height 0.9 mm; REACH SVHC: No SVHC; ComponentLink3URL: http://www.fairchildsemi.com/dwg/MA/MA03D.pdf; Voltage Rating (DC): 50 V; Width: 0.8 mm; ComponentLink1URL: http://www.avagotech.com/; Max Operating Temperature: 155 degC; Case Code (Imperial): 0603; Height: 0.45 mm
HDMIPORT = CMP-1502-00169-1: HDMI Type A Receptacle WR-HDMI, Horizontal, SMT; Manufacturer: Wurth Elektronik; Contact Resistance: 30mOhm; Working Voltage: 40VDC; Rated Current: 0.5A; Publisher: WurthElektronik; Datasheet URL: https://katalog.we-online.de/em/datasheet/685119134923.pdf; Gender: Receptacle; Manufacturer URL: http://www.we-online.de; Orientation: Horizontal; Mounting Technology: SMT; Part Number: 685119134923; Packaging: TapeandReel; Package Reference: 685119134923; Operating Temperature: -20to85degC; Connector Type: HDMITypeA; LCSC Part #: *
IC2 = CMP-07103-000004-1: IC USB SWITCH DPDT 10MSOP; Voltage: 4.3V; Current: 100mA; Number of Inputs: 2; Supply Type: Single; Number of Outputs: 4; Data Rate: 480Mbps; On-State Resistance: 6.5R; Min Supply Voltage: 3V; Package Quantity: 1; Length: 3mm; Radiation Hardening: No; Number of Pins: 10; Width: 3mm; Number of Channels: 2; REACH SVHC: No SVHC; Lead Free: Lead Free; Max Operating Temperature: 85°C; Min Operating Temperature: -40°C; Packaging: Tape and Reel; Throw Configuration: DPDT; Operating Supply Voltage: 4.3V; Max Supply Voltage: 4.3V; Mount: Surface Mount; Case/Package: MSOP; Weight: 0.1125g; Height: 0.85mm; LCSC Part #: C11355
JTAG = CMP-1502-01528-1: SMT ZIF Connectors WR-FPC, Horizontal, Bottom Contact, pitch 0.5 mm, 8 pins; Manufacturer: Wurth Elektronik; Contact Resistance: 20mOhm; Pitch: 0.5mm; Withstanding Voltage: 250VAC; Working Voltage: 50VAC; Pin Number: 8; Rated Current: 0.5A; Contact Design: BottomContact; Publisher: WurthElektronik; Orientation: Horizontal; Manufacturer URL: http://www.we-online.de; Part Number: 68710814522; Mounting Technology: SMT; Packaging: TapeandReel; Package Reference: 68710814522; Operating Temperature: -25to85degC; Datasheet URL: https://katalog.we-online.de/em/datasheet/68710814522.pdf
Q1-Q5 = CMP-2000-07450-1: N-Channel Enhancement Mode MOSFET, 20 V, 630 mA, -55 to 150 degC, 3-Pin SOT23, RoHS, Tape and Reel; Manufacturer: Diodes Inc; Continuous Drain Current (ID): 630mA; Number of Channels: 1; Drain to Source Voltage (Vdss): 20V; Gate to Source Voltage (Vgs): 6V; Turn-On Delay Time: 5.1ns; Rds On Max: 400mOhm; Power Dissipation: 280mW; Fall Time: 12.3ns; Input Capacitance: 60.67pF; Turn-Off Delay Time: 26.7ns; Rise Time: 7.4ns; Drain to Source Resistance: 300mOhm; Element Configuration: Single; Case\/Package: SOT-523; Threshold Voltage: 1V; Manufacturer URL: http://www.diodes.com/; Datasheet URL: https://www.diodes.com/assets/Datasheets/ds31783.pdf; Mount: SurfaceMount; Width: 0.85mm; REACH SVHC: NoSVHC; Datasheet Version: Rev. 3-2, 01/2012; Lead Free: LeadFree; Number of Pins: 3; Drain to Source Breakdown Voltage: 20V; Height: 0.8mm; Length: 1.7mm; Radiation Hardening: No; Packaging: TapeandReel; Contact Plating: Matte; Max Operating Temperature: 150degC; RoHSCompliant: true; Weight: 7.1E-05oz; Package Reference: SOT523-3; Package Quantity: 3000; Max Power Dissipation: 280mW; Package Description: 3-Pin Small Outline Transistor, Body 1.6 x 0.8 mm, Pitch 0.5 mm; On-State Resistance: 400MOhm; Min Operating Temperature: -55degC; Number of Elements: 1; Mounting Technology: SurfaceMount; LCSC Part #: C20512
R11#1 R14#1 R15#1 = Res1: 47k 0402; Published: 8-Jun-2000; LatestRevisionDate: 17-Jul-2002; LatestRevisionNote: Re-released for DXP Platform.; PackageReference: AXIAL-0.3; Publisher: Altium Limited; PackageDescription: Axial Device, Thru-Hole; 2 Leads; 0.3 in Pin Spacing; LCSC Part #: C25792
  R11#1: Value: 47K
  R14#1 R15#1: Value: 47k
R12#1 R22 = Res1: 100k 0402; Published: 8-Jun-2000; LatestRevisionDate: 17-Jul-2002; LatestRevisionNote: Re-released for DXP Platform.; PackageReference: AXIAL-0.3; Publisher: Altium Limited; PackageDescription: Axial Device, Thru-Hole; 2 Leads; 0.3 in Pin Spacing
R13#1 = CMP-2002-07344-1: as R7 on sheet 200PinConnector
R16#1 R17 = Res1: 1k 0402; Published: 8-Jun-2000; LatestRevisionDate: 17-Jul-2002; LatestRevisionNote: Re-released for DXP Platform.; PackageReference: AXIAL-0.3; Publisher: Altium Limited; PackageDescription: Axial Device, Thru-Hole; 2 Leads; 0.3 in Pin Spacing
R20 R21 = Res1: 1.8k 0402; Published: 8-Jun-2000; LatestRevisionDate: 17-Jul-2002; LatestRevisionNote: Re-released for DXP Platform.; PackageReference: AXIAL-0.3; Publisher: Altium Limited; PackageDescription: Axial Device, Thru-Hole; 2 Leads; 0.3 in Pin Spacing
SJ2 = Res1: Resistor; Published: 8-Jun-2000; LatestRevisionDate: 17-Jul-2002; LatestRevisionNote: Re-released for DXP Platform.; PackageReference: AXIAL-0.3; Publisher: Altium Limited; PackageDescription: Axial Device, Thru-Hole; 2 Leads; 0.3 in Pin Spacing; Value: 0R; LCSC Part #: C21189
TP4 TP5 = CMP-2000-05575-2: as TP8 on sheet 200PinConnector; Device Class L1: Connectors; Manufacturer Part Number: 5004; Digikey Description: PC TEST POINT MINIATURE YELLOW; ComponentLink2URL: https://www.keyelco.com/product-pdf.cfm?p=1313; Lead Free: Yes; ComponentLink2Description: Datasheet; Category: Conn; Height: 4.72mm; Octopart: https://octopart.com/5004-keystone-28591; Mouser Description: TEST POINT PC MINI .040"D YELLOW; Device Class L3: unset; Contact Material: Silver; Package: 5004; Automotive: No; Device Class L2: unset; RoHS: TRUE
U6 = CMP-12752-000002-1: LOAD SWITCH SC59; Min Supply Voltage: 2.7V; Interface: On/Off; Turn-On Delay Time: 700us; Voltage: 5.2V; Current: 200mA; Output Configuration: High Side; Number of Outputs: 1; On-State Resistance: 350mR; Fault Protection: Over Temperature; Min Operating Temperature: -40°C; Number of Pins: 59; Max Operating Temperature: 85°C; Height: 1.3mm; Package Quantity: 3000; REACH SVHC: No SVHC; Radiation Hardening: No; Output Current: 200mA; Max Supply Voltage: 5.2V; Max Output Current: 200mA; Case/Package: TO-236-3; Width: 1.7mm; Mount: Surface Mount; Packaging: Tape and Reel; Length: 3.1mm; LCSC Part #: *
U14 = CMP-1061-00155-1: as U7 on sheet 200PinConnector; PackageDescription: 6-Pin Small Outline Transistor, Body 2 x 1.25 mm, Pitch 0.65 mm; PackageReference: SC70-6-419B-02_W; ComponentLink2Description: Datasheet; Mounting Technology: Surface Mount; Packing: Tape and Reel; DatasheetVersion: Rev. 4; ComponentLink1Description: Manufacturer URL; ComponentLink2URL: http://www.onsemi.com/pub_link/Collateral/SMF05C-D.PDF; ComponentLink3Description: Package Specification; ComponentLink1URL: http://www.onsemi.com/; ComponentLink3URL: http://www.onsemi.com/pub_link/Collateral/SMF05C-D.PDF; PackageVersion: Rev. W; PartNumber: SMF05CT1G; RoHS: Pb-Free
USBA = CMP-1502-03227-1: USB 2.0 Type A Receptacle WR-COM, Horizontal, THT; Manufacturer: Wurth Elektronik; Working Voltage: 30VAC; Rated Current: 1.5A; Contact Resistance: 20mOhm; Manufacturer URL: http://www.we-online.de; Publisher: WurthElektronik; Packaging: Tray; Operating Temperature: -40to105degC; Orientation: Horizontal; Mounting Technology: THT; Part Number: 61400416021; Gender: Receptacle; Package Reference: 61400416021; Connector Type: USB2.0TypeA; Datasheet URL: https://katalog.we-online.de/em/datasheet/61400416021.pdf; LCSC Part #: *
USBB1 = CMP-1698-00007-1: Micro USB 2.0 B Receptacle, -55 to 85 degC, 5-Pin SMD, RoHS, Tape and Reel; Type (Resistor): Thick Film; Case\Package: 0603; Resistance: 4.7 kohm; Tolerance: 1%; Voltage Rating: 75 V; Power Rating: 100 mW; Case Code (Imperial): 0603; Case Code (Metric): 1608; REACH SVHC: Unknown; ComponentLink1URL: http://portal.fciconnect.com/; Package Quantity: 5000; RoHSCompliant: true; Max Operating Temperature: 155 degC; Min Operating Temperature: -55 degC; Mount: Surface Mount; Weight: 7.1E-05 oz; Length: 1.55 mm; PackageDescription: 5-Pin Surface Mount Device, Body 8.04 x 5.62 mm; Pins: 2; Height: 0.45 mm; ComponentLink2Description: Datasheet; ComponentLink2URL: http://portal.fciconnect.com/Comergent//fci/drawing/10103594.pdf; PackageReference: FCI-10103594-0001LF; DatasheetVersion: Rev. A, 06/2010; Width: 0.85 mm; Packaging: Tape and Reel; ComponentLink1Description: Manufacturer URL; LCSC Part #: *
USBBOOT = Header 3: Header, 3-Pin; LatestRevisionDate: 17-Jul-2002; LatestRevisionNote: Re-released for DXP Platform.; Publisher: Altium Limited

## Sheet XC95144XL.SchDoc
size Letter
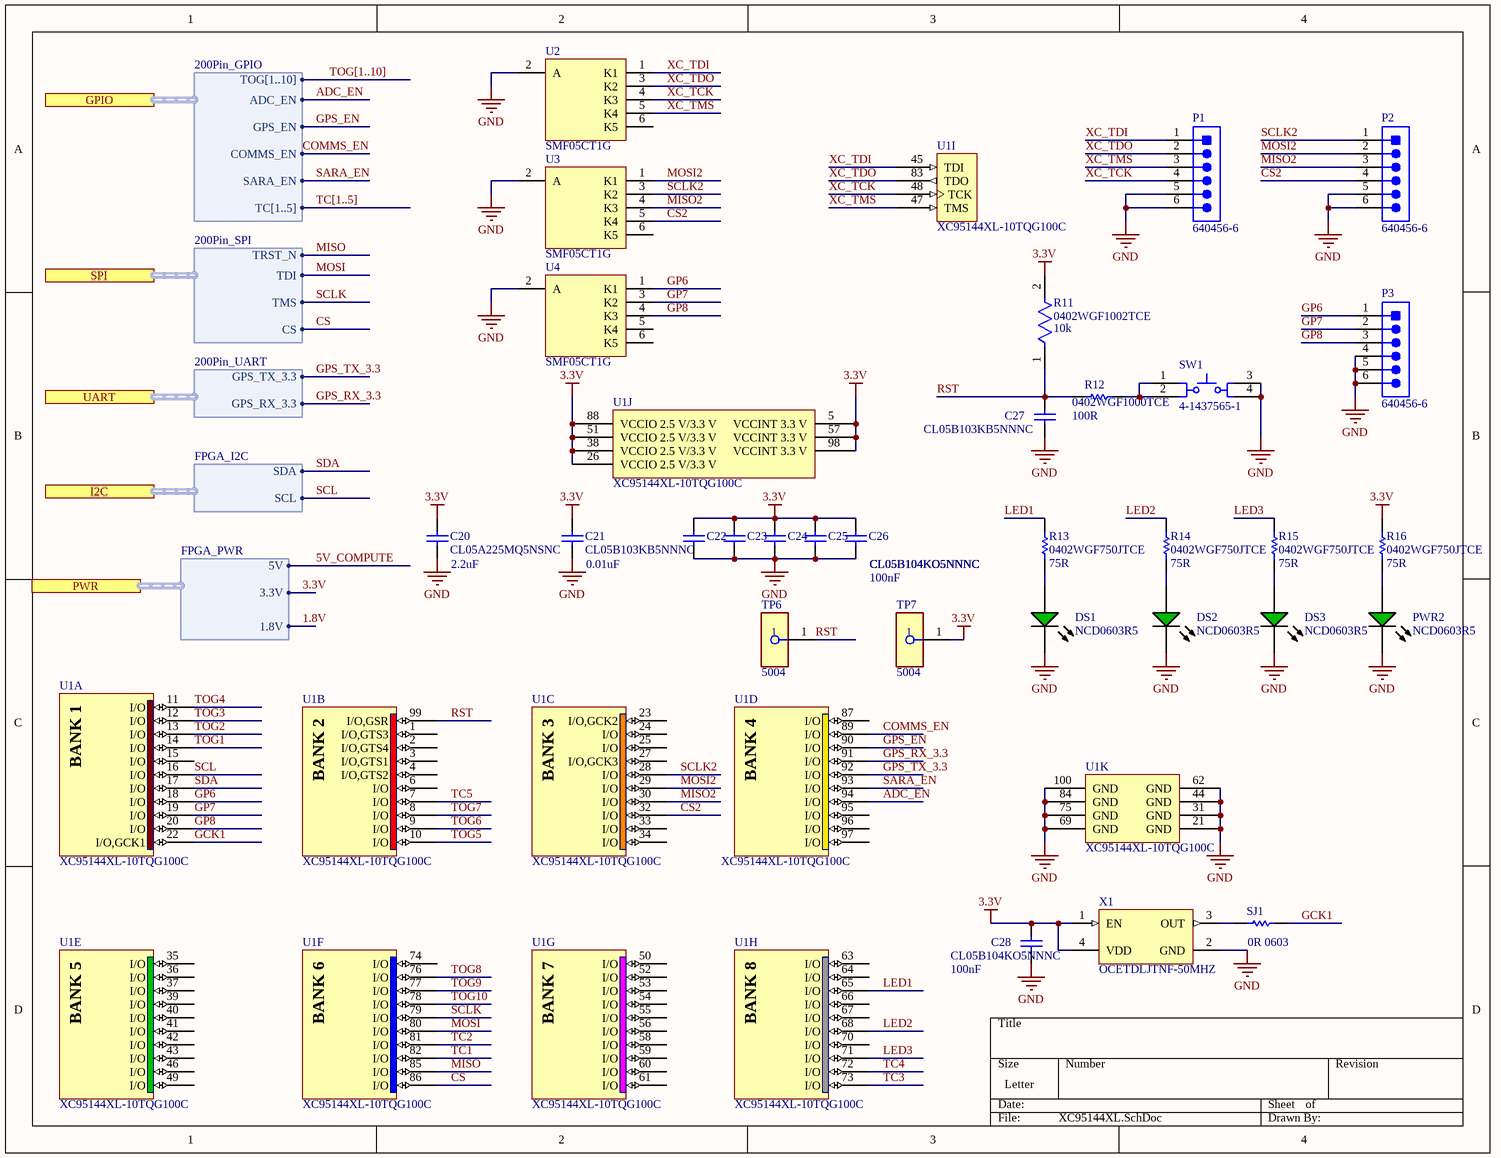
[diagram p3: XC95144XL.SchDoc]

### Parts
(Parts that share a designator on the sheet are numbered #1, #2 ... from top to bottom, then left to right.)
C20#2  CL05A225MQ5NSNC  [CAPC0402(1005)60_M]
C21#2  CL05B103KB5NNNC  [CAPC1005X55X30NL05T10]
C22#2  CL05B104KO5NNNC  [CAPC1005X55X30ML05T10]
C23#2  CL05B104KO5NNNC  [CAPC1005X55X30ML05T10]
C24#2  CL05B104KO5NNNC  [CAPC1005X55X30ML05T10]
C25#1  CL05B104KO5NNNC  [CAPC1005X55X30ML05T10]
C26#1  CL05B104KO5NNNC  [CAPC1005X55X30ML05T10]
C27#1  CL05B103KB5NNNC  [CAPC1005X55X30NL05T10]
C28#1  CL05B104KO5NNNC  [CAPC1005X55X30ML05T10]
DS1#1  NCD0603R5  [AVAG-HSMX-C190_V]
DS2  NCD0603R5  [AVAG-HSMX-C190_V]
DS3  NCD0603R5  [AVAG-HSMX-C190_V]
P1  640456-6  [TECO-640456-6_V]
P2  640456-6  [TECO-640456-6_V]
P3  640456-6  [TECO-640456-6_V]
PWR2  NCD0603R5  [AVAG-HSMX-C190_V]
R11#2  0402WGF1002TCE  [FP-CRCW0402-e3-IPC_B]
R12#2  0402WGF1000TCE  spec: 100R  [RESC1005X40X25ML05T10]
R13#2  0402WGF750JTCE  spec: 75R  [RESC1005X40X25ML05T10]
R14#2  0402WGF750JTCE  spec: 75R  [RESC1005X40X25ML05T10]
R15#2  0402WGF750JTCE  spec: 75R  [RESC1005X40X25ML05T10]
R16#2  0402WGF750JTCE  spec: 75R  [RESC1005X40X25ML05T10]
SJ1  0R 0603  [RESC1609X55X30ML10T20]
SW1#1  4-1437565-1  [TECO-4-1437565-1_V]
TP6#1  5004  [FP-5004-MFG]
TP7#1  5004  [FP-5004-MFG]
U1#1  XC95144XL-10TQG100C  [TQG100_L]  (parts A,B,C,D,E,F,G,H,I,J,K of 11)
U2  SMF05CT1G  [ONSC-SC70-6-419B-02_W_V]
U3  SMF05CT1G  [ONSC-SC70-6-419B-02_W_V]
U4  SMF05CT1G  [ONSC-SC70-6-419B-02_W_V]
X1  OCETDLJTNF-50MHZ  [TXC-L500W700H130-4_V]

### Ports
GPIO (harness 200Pin_GPIO), I2C (harness FPGA_I2C), PWR (harness FPGA_PWR), SPI (harness 200Pin_SPI), UART (harness 200Pin_UART)

### Harnesses
FPGA_PWR: 5V, 3.3V, 1.8V
FPGA_I2C: SDA, SCL
200Pin_UART: GPS_TX_3.3, GPS_RX_3.3
200Pin_SPI: TRST_N, TDI, TMS, CS
200Pin_GPIO: TOG[1..10], ADC_EN, GPS_EN, COMMS_EN, SARA_EN, TC[1..5]

### Nets
3.3V: C20#2.2 C21#2.2 C22#2.2 C23#2.2 C24#2.2 C25#1.2 C26#1.2 C28#1.2 R11#2.2 R16#2.2 TP7#1.1 U1#1.5(VCCINT_3.3_V) U1#1.26(VCCIO_2.5_V/3.3_V) U1#1.38(VCCIO_2.5_V/3.3_V) U1#1.51(VCCIO_2.5_V/3.3_V) U1#1.57(VCCINT_3.3_V) U1#1.88(VCCIO_2.5_V/3.3_V) U1#1.98(VCCINT_3.3_V) X1.1(EN) X1.4(VDD) ; port PWR.3.3V
GND: C20#2.1 C21#2.1 C22#2.1 C23#2.1 C24#2.1 C25#1.1 C26#1.1 C27#1.1 C28#1.1 DS1#1.2(K) DS2.2(K) DS3.2(K) P1.5 P1.6 P2.5 P2.6 P3.4 P3.5 P3.6 PWR2.2(K) SW1#1.3 SW1#1.4 U1#1.21(GND) U1#1.31(GND) U1#1.44(GND) U1#1.62(GND) U1#1.69(GND) U1#1.75(GND) U1#1.84(GND) U1#1.100(GND) U2.2(A) U3.2(A) U4.2(A) X1.2(GND)
ADC_EN: U1#1.94(I/O) ; port GPIO.ADC_EN
COMMS_EN: U1#1.89(I/O) ; port GPIO.COMMS_EN
CS: U1#1.86(I/O) ; port SPI.CS
CS2: P2.4 U1#1.32(I/O) U3.5(K4)
GCK1: SJ1.2 U1#1.22(I/O,GCK1)
GP6: P3.1 U1#1.18(I/O) U4.1(K1)
GP7: P3.2 U1#1.19(I/O) U4.3(K2)
GP8: P3.3 U1#1.20(I/O) U4.4(K3)
GPS_EN: U1#1.90(I/O) ; port GPIO.GPS_EN
GPS_RX_3.3: U1#1.91(I/O) ; port UART.GPS_RX_3.3
GPS_TX_3.3: U1#1.92(I/O) ; port UART.GPS_TX_3.3
LED1: R13#2.2 U1#1.65(I/O)
LED2: R14#2.2 U1#1.68(I/O)
LED3: R15#2.2 U1#1.71(I/O)
MISO: U1#1.85(I/O) ; port SPI.TRST_N
MISO2: P2.3 U1#1.30(I/O) U3.4(K3)
MOSI: U1#1.80(I/O) ; port SPI.TDI
MOSI2: P2.2 U1#1.29(I/O) U3.1(K1)
RST: C27#1.2 R11#2.1 R12#2.2 TP6#1.1 U1#1.99(I/O,GSR)
SARA_EN: U1#1.93(I/O) ; port GPIO.SARA_EN
SCL: U1#1.16(I/O) ; port I2C.SCL
SCLK: U1#1.79(I/O) ; port SPI.TMS
SCLK2: P2.1 U1#1.28(I/O) U3.3(K2)
SDA: U1#1.17(I/O) ; port I2C.SDA
TC1: U1#1.82(I/O)
TC2: U1#1.81(I/O)
TC3: U1#1.73(I/O)
TC4: U1#1.72(I/O)
TC5: U1#1.7(I/O)
TOG1: U1#1.14(I/O)
TOG2: U1#1.13(I/O)
TOG3: U1#1.12(I/O)
TOG4: U1#1.11(I/O)
TOG5: U1#1.10(I/O)
TOG6: U1#1.9(I/O)
TOG7: U1#1.8(I/O)
TOG8: U1#1.76(I/O)
TOG9: U1#1.77(I/O)
TOG10: U1#1.78(I/O)
XC_TCK: P1.4 U1#1.48(TCK) U2.4(K3)
XC_TDI: P1.1 U1#1.45(TDI) U2.1(K1)
XC_TDO: P1.2 U1#1.83(TDO) U2.3(K2)
XC_TMS: P1.3 U1#1.47(TMS) U2.5(K4)
NetDS1#1_1: DS1#1.1(A) R13#2.1
NetDS2_1: DS2.1(A) R14#2.1
NetDS3_1: DS3.1(A) R15#2.1
NetPWR2_1: PWR2.1(A) R16#2.1
NetR12#2_1: R12#2.1 SW1#1.1 SW1#1.2
NetSJ1_1: SJ1.1 X1.3(OUT)

Not connected (* = marked no-connect by the designer): U1#1 1(I/O,GTS3) 2(I/O,GTS4) 3(I/O,GTS1) 4(I/O,GTS2) 6(I/O) 15(I/O) 23(I/O,GCK2) 24(I/O) 25(I/O) 27(I/O,GCK3) 33(I/O) 34(I/O) 35(I/O) 36(I/O) 37(I/O) 39(I/O) 40(I/O) 41(I/O) 42(I/O) 43(I/O) 46(I/O) 49(I/O) 50(I/O) 52(I/O) 53(I/O) 54(I/O) 55(I/O) 56(I/O) 58(I/O) 59(I/O) 60(I/O) 61(I/O) 63(I/O) 64(I/O) 66(I/O) 67(I/O) 70(I/O) 74(I/O) 87(I/O) 95(I/O) 96(I/O) 97(I/O); U2 6(K5); U3 6(K5); U4 5(K4) 6(K5)

### Buses and harness runs
bus TC[1..5]
bus TOG[1..10]

### Notes on the sheet
- (near R11#2) 10k
- (near C20#2) 2.2uF
- (near C21#2) 0.01uF
- (near C26#1) 100nF
- (near C28#1) 100nF
- (in symbol CMP-0209-00147-1, part A) BANK 1
- (in symbol CMP-0209-00147-1, part B) BANK 2
- (in symbol CMP-0209-00147-1, part C) BANK 3
- (in symbol CMP-0209-00147-1, part D) BANK 4
- (in symbol CMP-0209-00147-1, part E) BANK 5
- (in symbol CMP-0209-00147-1, part F) BANK 6
- (in symbol CMP-0209-00147-1, part G) BANK 7
- (in symbol CMP-0209-00147-1, part H) BANK 8

### Library data of the parts
C20#2 = CMP-1034-02125-1: 2.2uF 0402; Case-Metric: 1005; Rated Voltage: 6.3 V; Case-EIA: 0402; Tolerance: Â±10%; Value: 2.2uF; Technology: SMT; Max Thickness: 0.6 mm
C21#2 C27#1 = CMP-2008-03072-1: 0.01uF 0402; Manufacturer: Kemet; Part Number: C0402C103K4RACTU
C22#2 C23#2 C24#2 C25#1 C26#1 C28#1 = CMP-2008-03080-1: 100nF 0402; Manufacturer: Kemet; Part Number: C0402C104J4RACTU
DS1#1 DS2 DS3 PWR2 = CMP-1744-00002-1: Chip LED, Green, 2.2 V, -40 to 85 degC, 2-Pin SMD, RoHS, Tape and Reel; Frequency: 400 KHz; Max Supply Voltage: 5.5 V; Access Time: 3500 ns; Clock Frequency: 100 KHz; Case\Package: SOIC; Density: 32 kb; Nominal Supply Current: 2 mA; Interface: Serial; Min Supply Voltage: 1.7 V; Packaging: Tape and Reel; PackageReference: HSMX-C190; ComponentLink2URL: http://docs.avagotech.com/docs/AV02-0551EN; RoHSCompliant: true; Pins: 8; REACH SVHC: No SVHC; Max Operating Temperature: 85 degC; Width: 4 mm; Radiation Hardening: No; Package Quantity: 3000; ComponentLink3Description: Package Specification; ComponentLink1Description: Manufacturer URL; Min Operating Temperature: -40 degC; PackageDescription: 2-Pin Surface Mount Device, Body 1.6 x 0.8 mm, Height 0.9 mm; Max Clock Frequency: 100 KHz; Height: 1.5 mm; ComponentLink1URL: http://www.avagotech.com/; DatasheetVersion: Mar-12; ComponentLink2Description: Datasheet; Mount: Surface Mount; Length: 5 mm; ComponentLink3URL: http://www.fairchildsemi.com/dwg/MA/MA03D.pdf
P1-P3 = CMP-2000-05661-1: as P4 on sheet 200PinConnector; Termination: Solder; Package Reference: 640456-6; Size, Post: 0.025 / in.; Color: White; Datasheet URL: https://datasheet.ciiva.com/25618/0900766b80eb7fdd-25618163.pdf; Manufacturer URL: http://www.te.com/; Mounting Type: PCMount; Length, Pin: 0.14 / "; Type: PCBPlug; Length, Overall: 0.6 / "; Mounting Technology: ThroughHole; Number of Rows: 1; Contact Shape: Square; Contact Mating Area Plating: Tin; Datasheet Version: Rev. W, 05/2005; Number of Positions: 6; Package Description: Male Header, Pitch 2.54 mm, 1 x 6 Position, Height 10.03 mm, Tail Length 3.56 mm; Contact Plating: Tin; Length, Terminal Post: 0.14 / in.; Flammability Rating: UL94V-0
R11#2 = CMP-02407-001195-1: 10k 0402; Power Rating: 63mW; Resistance: 10kR; Tolerance: 1%; Voltage Rating: 50V; Temperature Coefficient: 100ppm/°C; Case Code (Metric): 1005; Features: Automotive AEC-Q200; Termination: SMD/SMT; Mount: Surface Mount; Package Quantity: 10; Packaging: Tape and Reel; Case Code (Imperial): 0402; Weight: 2.3E-05oz; Lead Free: Lead Free; Width: 0.02inch; Max Power Dissipation: 63mW; Number of Terminations: 2; Height: 0.35mm; Number of Pins: 2; Composition: Thick Film; Length: 1mm; Voltage Rating (DC): 50V; Case/Package: 0402; Radiation Hardening: No; Contact Plating: Tin; Depth: 0.5mm; Military Standard: Not; Min Operating Temperature: -55°C; Max Operating Temperature: 155°C
R12#2 = CMP-2002-07344-1: 100R 0402; Part Number: RC0402FR-07100RL; Manufacturer: Yageo / Phycomp
R13#2 R14#2 R15#2 R16#2 = CMP-2002-07344-1: as R7 on sheet 200PinConnector
SJ1 = CMP-2000-03816-1: Part Number: CRCW06030000Z0EA; Manufacturer: Vishay Dale
SW1#1 = CMP-2000-05602-1: Tactile Switch, 50 mA, 12 VDC, -20 to 85 degC, 4-Pin SMD, RoHS, Bulk; Manufacturer: TEConnectivity/AMPBrand; Illumination Type: N/R; Maximum Contact Resistance: 100mOhm; Actuator Style: RoundButton; Actuator Length: 1.4mm; Contact Rating @ Voltage: 0.05@12VDCA; Maximum DC Voltage Rating: 12V; Body Orientation: Straight; Ground Terminal: No; Dielectric Strength: 500VAC; Operating Force: 1.57N; Electrical Life: 100000Cycle; Mechanical Life: N/A; Family: FSMJSMA; Contact Material: CopperAlloy; Type: N/A; RoHS: Yes; Pole Throw Configuration: N/A; Operating Temperature: -20to85C; Minimum Insulation Resistance: 100MOhm; Package Description: 4-Pin Surface Mount Device, Body 6 x 6 mm, Pitch 9.1 mm; Housing Material: N/A; Switch Configuration: N/A; Mounting: SurfaceMount,GullWing; Datasheet URL: https://datasheet.ciiva.com/14635/0900766b80912216-14635826.pdf; Packaging: Bulk; Base Material: N/A; Actuator Color: N/A; Dimension: 6x10x5.25mm; Contact Plating: Silver; Seal Location: N/A; Mounting Technology: SurfaceMount; Part No: 4-1437565-1; Seal Description: N/A; Maximum AC Voltage Rating: N/A; Datasheet Version: 04/2007; Manufacturer URL: http://www.te.com/; Package Reference: 4-1437565-1; Product Weight: N/A
TP6#1 TP7#1 = CMP-2000-05575-2: as TP8 on sheet 200PinConnector; Device Class L1: Connectors; Manufacturer Part Number: 5004; Digikey Description: PC TEST POINT MINIATURE YELLOW; ComponentLink2URL: https://www.keyelco.com/product-pdf.cfm?p=1313; Lead Free: Yes; ComponentLink2Description: Datasheet; Category: Conn; Height: 4.72mm; Octopart: https://octopart.com/5004-keystone-28591; Mouser Description: TEST POINT PC MINI .040"D YELLOW; Device Class L3: unset; Contact Material: Silver; Package: 5004; Automotive: No; Device Class L2: unset; RoHS: TRUE
U1#1 = CMP-0209-00147-1: FastFLASH XC900XL, 3.3V High-Performance 144 Macrocell CPLD, 81 User I/Os, 100-Pin TQFP, Speed Grade 10, Commercial Grade, Pb-Free; PackageDescription: 100-Pin Thin Quad Flat Pack (TQG100) - Pb-Free; PackageVersion: ver1.2, Jun-2004; DatasheetVersion: ver2.0, Apr-2007; PackageReference: TQG100
U2-U4 = CMP-1061-00155-1: as U7 on sheet 200PinConnector; PackageDescription: 6-Pin Small Outline Transistor, Body 2 x 1.25 mm, Pitch 0.65 mm; PackageReference: SC70-6-419B-02_W; ComponentLink2Description: Datasheet; Mounting Technology: Surface Mount; Packing: Tape and Reel; DatasheetVersion: Rev. 4; ComponentLink1Description: Manufacturer URL; ComponentLink2URL: http://www.onsemi.com/pub_link/Collateral/SMF05C-D.PDF; ComponentLink3Description: Package Specification; ComponentLink1URL: http://www.onsemi.com/; ComponentLink3URL: http://www.onsemi.com/pub_link/Collateral/SMF05C-D.PDF; PackageVersion: Rev. W; PartNumber: SMF05CT1G; RoHS: Pb-Free
X1 = CMP-0269-00001-1: OSC, 50.000 MHZ, ± 25 ppm, 3.3 V, SMT / OCETDLJTNF-50MHZ; PartNumber: 7W-50.000MBA-T; Rise/Fall Time: 7 ns; Body Shape: Rectangular, 4 SMD; Frequency Stability: Â± 25 ppm(-10 to +70 degC); ComponentLink2Description: Datasheet; Mounting Technology: Surface Mount; Storage Temperature: -50 to 125 degC; PackageReference: L500W700H130-4; ComponentLink1URL: http://www.txccrystal.com/; ComponentLink2URL: http://www.txccrystal.com/images/pdf/7w-tight.pdf; ComponentLink1Description: Manufacturer URL; PackageDescription: 4-Pin SMT LED, 7 x 5 mm Body; Operating Temperature Range: -40 to 85 degC